# EAGLE schematic FlightComputer_PDB (EAGLE 9.0.1)
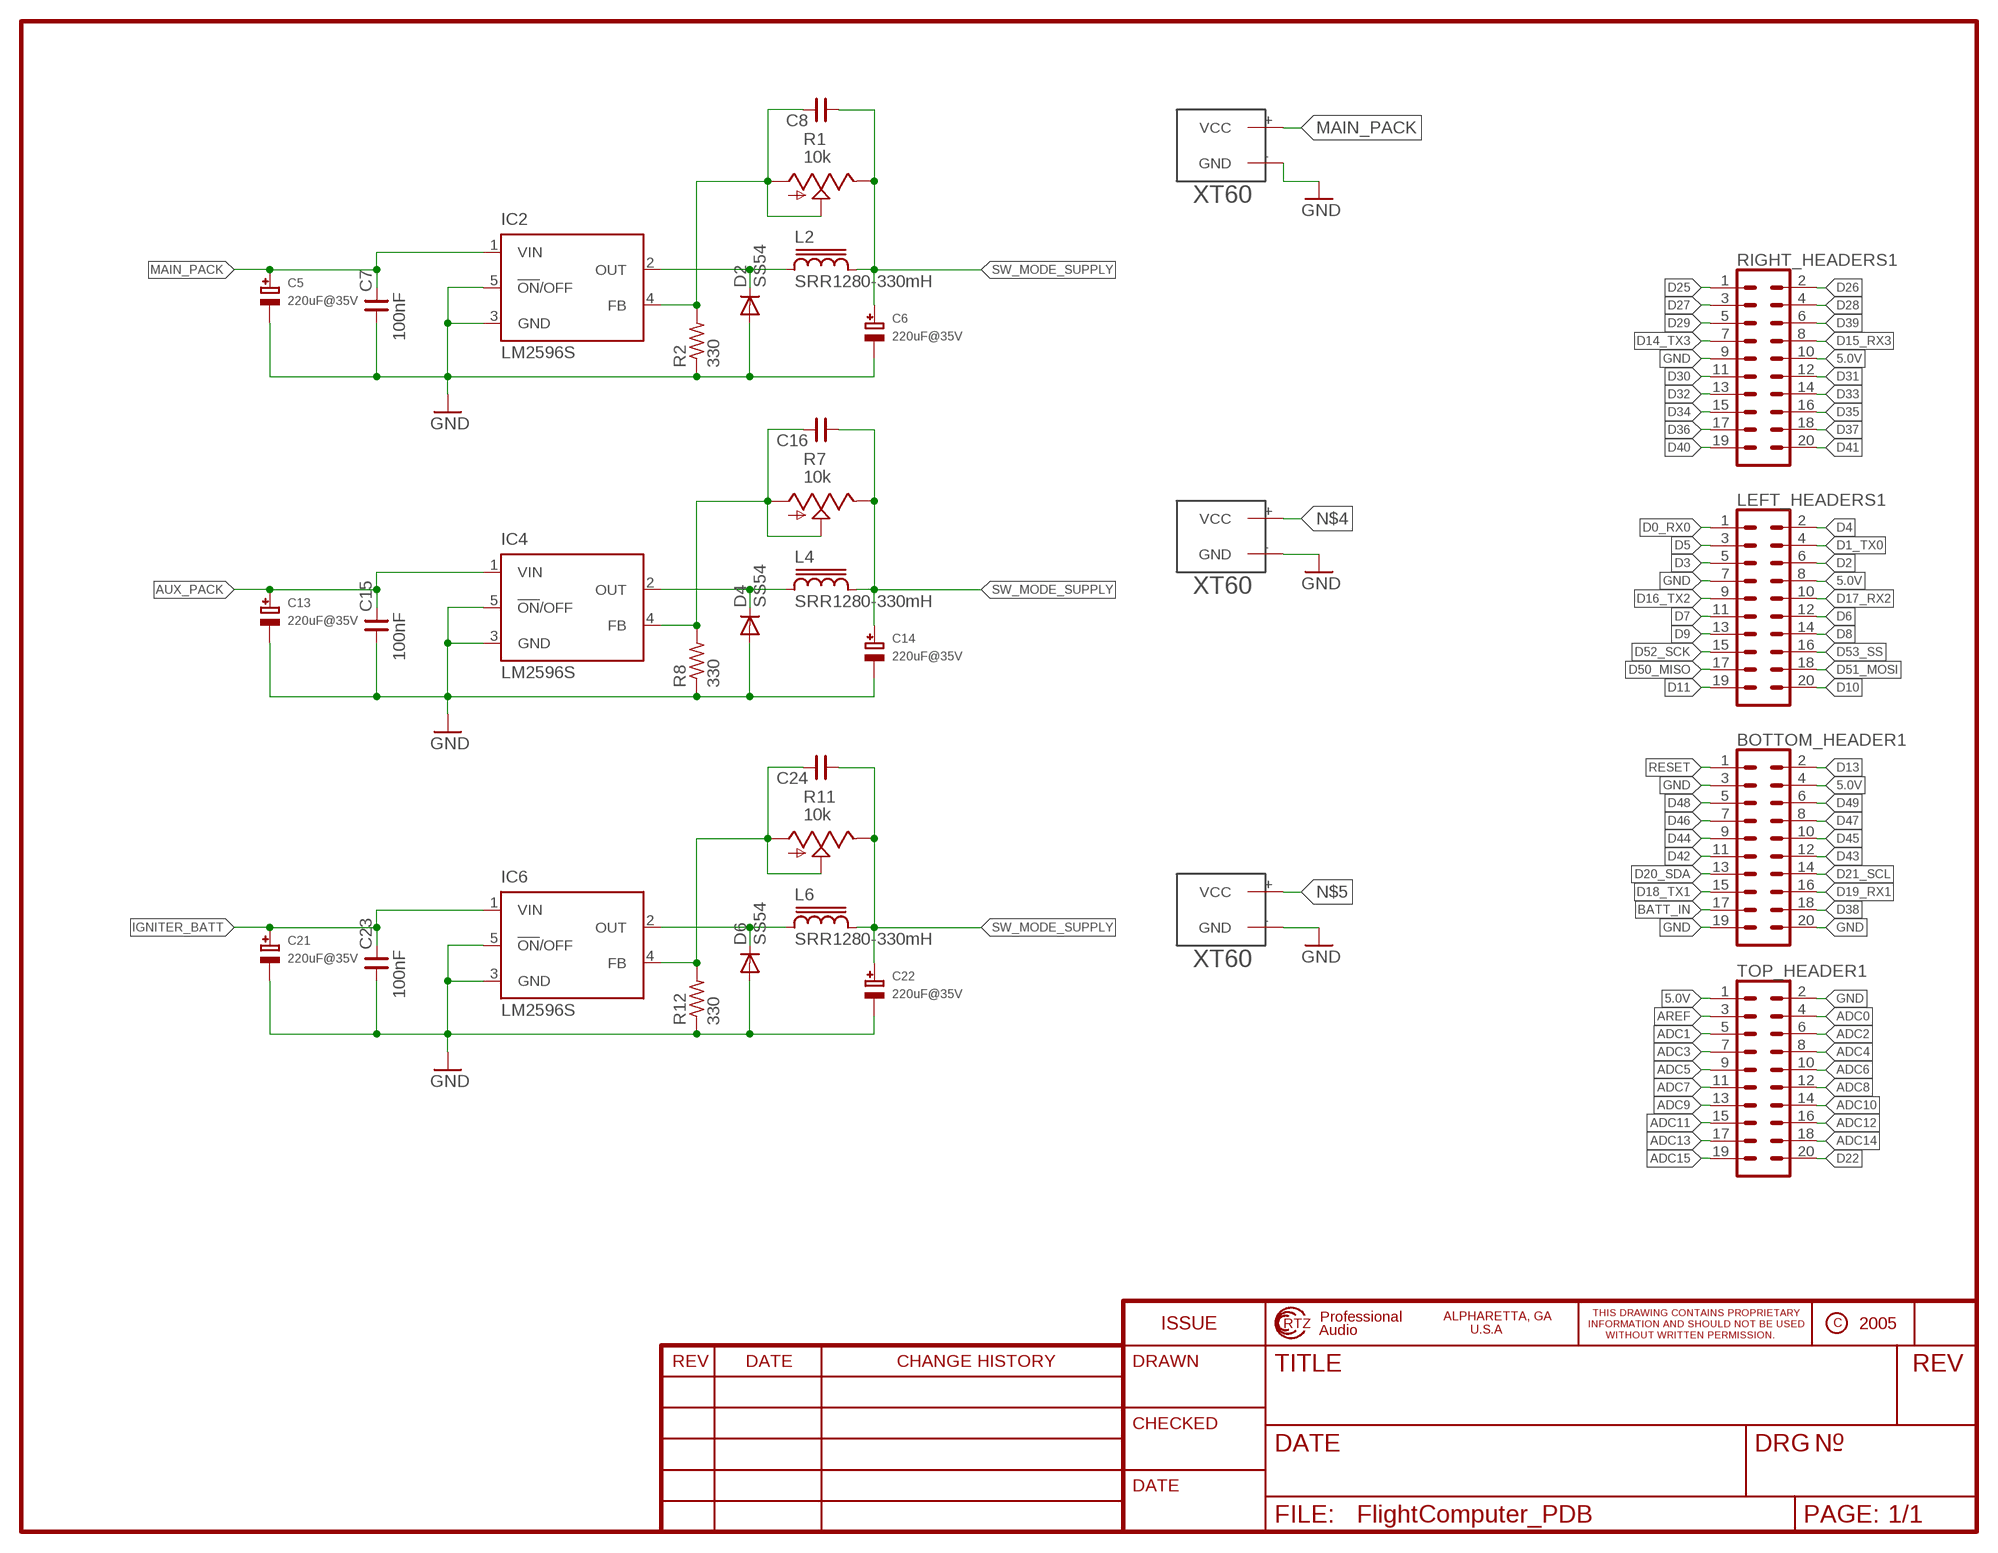
[diagram p0: schematic, sheet 1]

## Parts
BOTTOM_HEADER1  CONN_10X2  [2X10]
C5  220uF@35V  CAP_ELECTROLYTICPANASONIC_D  [PANASONIC_D]
C6  220uF@35V  CAP_ELECTROLYTICPANASONIC_D  [PANASONIC_D]
C7  100nF  CNP-0603  [0603]
C8  CNP-0603  [0603]
C13  220uF@35V  CAP_ELECTROLYTICPANASONIC_D  [PANASONIC_D]
C14  220uF@35V  CAP_ELECTROLYTICPANASONIC_D  [PANASONIC_D]
C15  100nF  CNP-0603  [0603]
C16  CNP-0603  [0603]
C21  220uF@35V  CAP_ELECTROLYTICPANASONIC_D  [PANASONIC_D]
C22  220uF@35V  CAP_ELECTROLYTICPANASONIC_D  [PANASONIC_D]
C23  100nF  CNP-0603  [0603]
C24  CNP-0603  [0603]
D2  SS54  S3G  [DO214AB]
D4  SS54  S3G  [DO214AB]
D6  SS54  S3G  [DO214AB]
IC2  LM2596S  [TO263-5]
IC4  LM2596S  [TO263-5]
IC6  LM2596S  [TO263-5]
L2  SRR1280-330mH  SRR1280  [SRR1280]
L4  SRR1280-330mH  SRR1280  [SRR1280]
L6  SRR1280-330mH  SRR1280  [SRR1280]
LEFT_HEADERS1  CONN_10X2  [2X10]
R1  10k  TRIM_US-S64W  [S64W]
R2  330  R-US_R0603  [R0603]
R7  10k  TRIM_US-S64W  [S64W]
R8  330  R-US_R0603  [R0603]
R11  10k  TRIM_US-S64W  [S64W]
R12  330  R-US_R0603  [R0603]
RIGHT_HEADERS1  CONN_10X2  [2X10]
TOP_HEADER1  CONN_10X2  [2X10]
U$1  XT60  [XT60]
U$2  XT60  [XT60]
U$3  XT60  [XT60]

## Nets
5.0V: BOTTOM_HEADER1.4 LEFT_HEADERS1.8 RIGHT_HEADERS1.10 TOP_HEADER1.1
ADC0: TOP_HEADER1.4
ADC1: TOP_HEADER1.5
ADC2: TOP_HEADER1.6
ADC3: TOP_HEADER1.7
ADC4: TOP_HEADER1.8
ADC5: TOP_HEADER1.9
ADC6: TOP_HEADER1.10
ADC7: TOP_HEADER1.11
ADC8: TOP_HEADER1.12
ADC9: TOP_HEADER1.13
ADC10: TOP_HEADER1.14
ADC11: TOP_HEADER1.15
ADC12: TOP_HEADER1.16
ADC13: TOP_HEADER1.17
ADC14: TOP_HEADER1.18
ADC15: TOP_HEADER1.19
AREF: TOP_HEADER1.3
AUX_PACK: C13.+ C15.2 IC4.1(VIN)
BATT_IN: BOTTOM_HEADER1.17
D0_RX0: LEFT_HEADERS1.1
D1_TX0: LEFT_HEADERS1.4
D2: LEFT_HEADERS1.6
D3: LEFT_HEADERS1.5
D4: LEFT_HEADERS1.2
D5: LEFT_HEADERS1.3
D6: LEFT_HEADERS1.12
D7: LEFT_HEADERS1.11
D8: LEFT_HEADERS1.14
D9: LEFT_HEADERS1.13
D10: LEFT_HEADERS1.20
D11: LEFT_HEADERS1.19
D13: BOTTOM_HEADER1.2
D14_TX3: RIGHT_HEADERS1.7
D15_RX3: RIGHT_HEADERS1.8
D16_TX2: LEFT_HEADERS1.9
D17_RX2: LEFT_HEADERS1.10
D18_TX1: BOTTOM_HEADER1.15
D19_RX1: BOTTOM_HEADER1.16
D20_SDA: BOTTOM_HEADER1.13
D21_SCL: BOTTOM_HEADER1.14
D22: TOP_HEADER1.20
D25: RIGHT_HEADERS1.1
D26: RIGHT_HEADERS1.2
D27: RIGHT_HEADERS1.3
D28: RIGHT_HEADERS1.4
D29: RIGHT_HEADERS1.5
D30: RIGHT_HEADERS1.11
D31: RIGHT_HEADERS1.12
D32: RIGHT_HEADERS1.13
D33: RIGHT_HEADERS1.14
D34: RIGHT_HEADERS1.15
D35: RIGHT_HEADERS1.16
D36: RIGHT_HEADERS1.17
D37: RIGHT_HEADERS1.18
D38: BOTTOM_HEADER1.18
D39: RIGHT_HEADERS1.6
D40: RIGHT_HEADERS1.19
D41: RIGHT_HEADERS1.20
D42: BOTTOM_HEADER1.11
D43: BOTTOM_HEADER1.12
D44: BOTTOM_HEADER1.9
D45: BOTTOM_HEADER1.10
D46: BOTTOM_HEADER1.7
D47: BOTTOM_HEADER1.8
D48: BOTTOM_HEADER1.5
D49: BOTTOM_HEADER1.6
D50_MISO: LEFT_HEADERS1.17
D51_MOSI: LEFT_HEADERS1.18
D52_SCK: LEFT_HEADERS1.15
D53_SS: LEFT_HEADERS1.16
GND: BOTTOM_HEADER1.3 BOTTOM_HEADER1.19 BOTTOM_HEADER1.20 C5.- C6.- C7.1 C13.- C14.- C15.1 C21.- C22.- C23.1 D2.A D4.A D6.A IC2.3(GND) IC2.5(!ON!/OFF) IC4.3(GND) IC4.5(!ON!/OFF) IC6.3(GND) IC6.5(!ON!/OFF) LEFT_HEADERS1.7 R2.1 R8.1 R12.1 RIGHT_HEADERS1.9 TOP_HEADER1.2 U$1.-(GND) U$2.-(GND) U$3.-(GND)
IGNITER_BATT: C21.+ C23.2 IC6.1(VIN)
MAIN_PACK: C5.+ C7.2 IC2.1(VIN) U$1.+(VCC)
N$1: D2.C IC2.2(OUT) L2.1
N$2: C8.2 IC2.4(FB) R1.A R1.S R2.2
N$4: U$2.+(VCC)
N$5: U$3.+(VCC)
N$7: D4.C IC4.2(OUT) L4.1
N$8: C16.2 IC4.4(FB) R7.A R7.S R8.2
N$11: D6.C IC6.2(OUT) L6.1
N$12: C24.2 IC6.4(FB) R11.A R11.S R12.2
RESET: BOTTOM_HEADER1.1
SW_MODE_SUPPLY: C6.+ C8.1 C14.+ C16.1 C22.+ C24.1 L2.2 L4.2 L6.2 R1.E R7.E R11.E

## Library data of the parts
BOTTOM_HEADER1 LEFT_HEADERS1 RIGHT_HEADERS1 TOP_HEADER1 = SparkFun-Connectors:CONN_10X2: Multi connection point. Often used as Generic Header-pin footprint for 0.1 inch spaced/style header connections On any of the 0.1 inch spaced packages, you can populate with these: Break Away Headers - Straight <https://www.sparkfun.com/products/116> (PRT-00116) Break Away Male Headers - Right Angle <https://www.sparkfun.com/products/553> (PRT-00553) Female Headers <https://www.sparkfun.com/products/115> (PRT-00115) Break Away Headers - Machine Pin <https://www.sparkfun.com/products/117> (PRT-00117) Break Away Female Headers - Swiss Machine Pin <https://www.sparkfun.com/products/743> (PRT-00743) Special note about the "SPECIAL" package: This was SPECIALLY designed to be used with our Graphic LCD Backpack. Be sure you want to use this! It is not only staggered on each line of header holes, but IT IS ALSO offset of the center point of the top and bottom lines by 5 mil. This causes the headers to lock into place on the "standard" footprint on the LCD screen. The extra squares on the tdocu layer are there simply to reference other pins (if you were to actually populate a longer header than ten long - this is what we do with the backpacks).
C5 C6 C13 C14 C21 C22 = microbuilder:CAP_ELECTROLYTIC: Electrolytic Capacitors PANASONIC_C - Size C Panasonic Electrolytic Aluminum Capacitor 47µF 16V 20% Electrolytic Capacitor [Digikey: PCE3890TR-ND] PANASONIC_D - Size D Panasonic Electrolytic Aluminum Capacitor 100µF 25V 20% Electrolytic Capacitor [Digikey: PCE3898TR-ND]
C7 C8 C15 C16 C23 C24 = cap-master:CNP-: NON-POLARIZED CAP
D2 D4 D6 = s3x_10:S3*: S3A - S3N General Purpose Rectifiers Source: http://www.fairchildsemi.com/datasheets/S3/S3A.pdf; MF: Fairchild; MPN: S3G; OC_FARNELL: 2454094; OC_NEWARK: 58K2397
IC2 IC4 IC6 = national-semiconductor:LM2596: SIMPLE SWITCHER® Power Converter 150 kHz 3A Step-Down Voltage Regulator Source: http://www.national.com/ds/LM/LM2596.pdf; MF: NATIONAL SEMICONDUCTOR; MPN: LM2596S-ADJ/NOPB; OC_FARNELL: 9494367; OC_NEWARK: 41K3842
L2 L4 L6 = inductor-bourns:SRR1280: POWER INDUCTOR
R1 R7 R11 = pot:TRIM_US-: POTENTIOMETER
R2 R8 R12 = adafruit:R-US_: RESISTOR, American symbol
U$1-U$3 = XT60:XT60: XT60